# Altium project BlackChat Receiver.PrjPcb
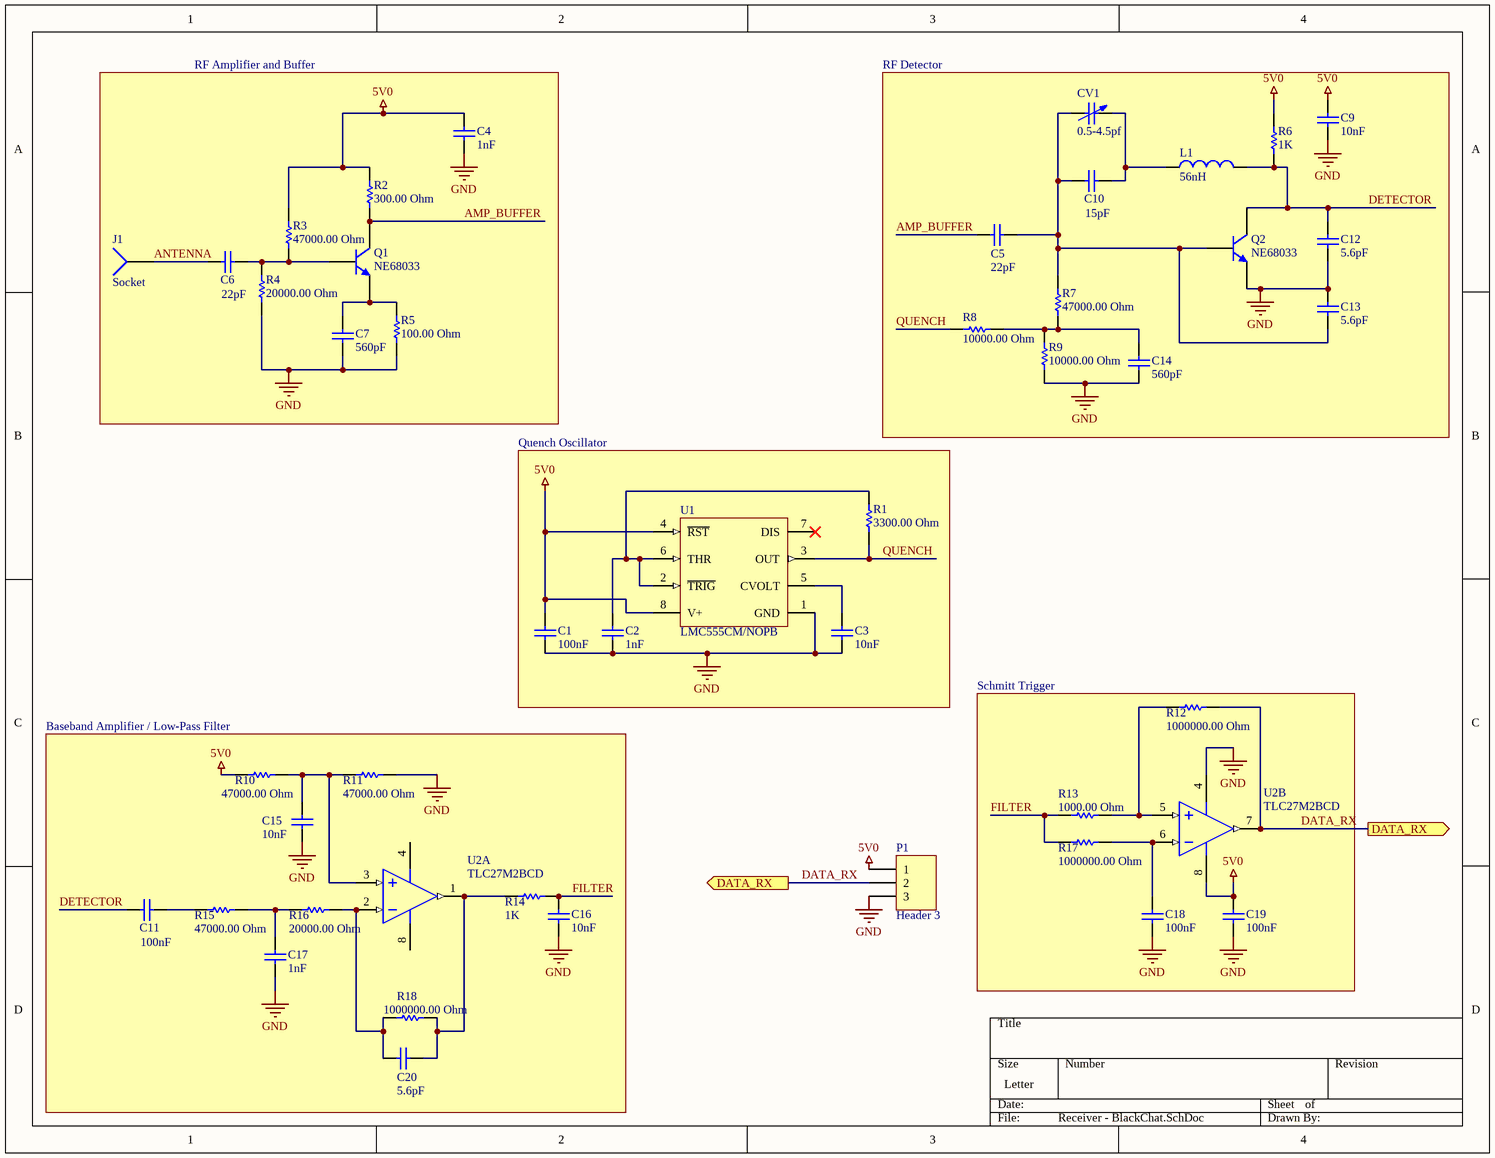
[diagram p0: Receiver - BlackChat.SchDoc]
1 sheet, 45 parts. Net scope: flat (ports and power ports of the same name join across sheets).
Board file: [R0] Receiver- BlackChat.PcbDoc

## Sheet Receiver - BlackChat.SchDoc
size Letter

### Parts
C1  value 100nF  [CAPC0805(2012)100_M]  (hidden comment: CAP 100nF 25V 0805(2012))
C2  value 1nF  [CAPC0805(2012)100_N]  (hidden comment: CAP 1nF 25V 0805(2012))
C3  value 10nF  [CAPC0805(2012)75_L]  (hidden comment: CAP 10nF 25V 0805(2012))
C4  value 1nF  [CAPC0805(2012)145_N]  (hidden comment: CAP 1nF 16V 0805(2012))
C5  value 22pF  [CAPC0805(2012)75_L]  (hidden comment: CAP 22pF 16V 0805(2012))
C6  value 22pF  [CAPC0805(2012)75_L]  (hidden comment: CAP 22pF 16V 0805(2012))
C7  value 560pF  [CAPC0805(2012)145_N]  (hidden comment: CAP 560pF 16V 0805(2012))
C9  value 10nF  [CAPC0805(2012)145_N]  (hidden comment: CAP 10nF 16V 0805(2012))
C10  value 15pF  [CAPC0805(2012)100_L]  (hidden comment: CAP 1.5pF 16V 0805(2012))
C11  value 100nF  [CAPC0805(2012)100_L]  (hidden comment: CAP 100nF 16V 0805(2012))
C12  value 5.6pF  [CAPC0805(2012)75_M]  (hidden comment: CAP 5.6pF 16V 0805(2012))
C13  value 5.6pF  [CAPC0805(2012)75_M]  (hidden comment: CAP 5.6pF 16V 0805(2012))
C14  value 560pF  [CAPC0805(2012)145_N]  (hidden comment: CAP 560pF 16V 0805(2012))
C15  value 10nF  [CAPC0805(2012)145_N]  (hidden comment: CAP 10nF 16V 0805(2012))
C16  value 10nF  [CAPC0805(2012)145_N]  (hidden comment: CAP 10nF 16V 0805(2012))
C17  value 1nF  [CAPC0805(2012)100_N]  (hidden comment: CAP 1nF 25V 0805(2012))
C18  value 100nF  [CAPC0805(2012)100_M]  (hidden comment: CAP 100nF 25V 0805(2012))
C19  value 100nF  [CAPC0805(2012)100_M]  (hidden comment: CAP 100nF 25V 0805(2012))
C20  value 5.6pF  [CAPC0805(2012)75_M]  (hidden comment: CAP 5.6pF 16V 0805(2012))
CV1  0.5-4.5pf  [CAP-GSX364]
J1  Socket  [PIN1]
L1  56nH  [C1210]
P1  Header 3  [HDR1X3]
Q1  NE68033  [SOT95P275X120-3N]
Q2  NE68033  [SOT95P275X120-3N]
R1  value 3300.00 Ohm  [RESC0805(2012)_M]  (hidden comment: 3K3 5% 0805(2012))
R2  value 300.00 Ohm  [RESC0805(2012)_M]  (hidden comment: 300R 1% 0805(2012))
R3  value 47000.00 Ohm  [RESC0805(2012)_L]  (hidden comment: 47K 5% 0805(2012))
R4  value 20000.00 Ohm  [RESC0805(2012)_L]  (hidden comment: 20K 5% 0805(2012))
R5  value 100.00 Ohm  [RESC0805(2012)_M]  (hidden comment: 100R 5% 0805(2012))
R6  value 1K  [RESC0805(2012)_N]  (hidden comment: 1K 5% 0805(2012))
R7  value 47000.00 Ohm  [RESC0805(2012)_L]  (hidden comment: 47K 5% 0805(2012))
R8  value 10000.00 Ohm  [RESC0805(2012)_L]  (hidden comment: 10K 5% 0805(2012))
R9  value 10000.00 Ohm  [RESC0805(2012)_L]  (hidden comment: 10K 5% 0805(2012))
R10  value 47000.00 Ohm  [RESC0805(2012)_N]  (hidden comment: 47K 1% 0805(2012))
R11  value 47000.00 Ohm  [RESC0805(2012)_N]  (hidden comment: 47K 1% 0805(2012))
R12  value 1000000.00 Ohm  [RESC0805(2012)_N]  (hidden comment: 1M 1% 0805(2012))
R13  value 1000.00 Ohm  [RESC0805(2012)_N]  (hidden comment: 1K 5% 0805(2012))
R14  value 1K  [RESC0805(2012)_N]  (hidden comment: 1K 5% 0805(2012))
R15  value 47000.00 Ohm  [RESC0805(2012)_N]  (hidden comment: 47K 1% 0805(2012))
R16  value 20000.00 Ohm  [RESC0805(2012)_N]  (hidden comment: 20K 1% 0805(2012))
R17  value 1000000.00 Ohm  [RESC0805(2012)_N]  (hidden comment: 1M 1% 0805(2012))
R18  value 1000000.00 Ohm  [RESC0805(2012)_N]  (hidden comment: 1M 1% 0805(2012))
U1  LMC555CM/NOPB  [M08A_M]
U2  TLC27M2BCD  [TI-D8_L]  (parts A,B of 2)

### Blocks framed on the sheet
RF Amplifier and Buffer: C4 C6 C7 J1 Q1 R2-R5
RF Detector: C5 C9 C10 C12-C14 CV1 L1 Q2 R6-R9
Quench Oscillator: C1-C3 R1 U1
Baseband Amplifier / Low-Pass Filter: C11 C15-C17 C20 R10 R11 R14-R16 R18 U2
Schmitt Trigger: C18 C19 R12 R13 R17 U2

### Ports
DATA_RX (out)

### Nets
5V0: C1.1 C4.2 C9.2 C19.1 P1.1 R2.2 R3.2 R6.2 R10.1 U1.4(~{RST}) U1.8(V+) U2.8(VCC)
GND: C1.2 C2.1 C3.1 C4.1 C7.2 C9.1 C12.1 C13.1 C14.1 C15.1 C16.1 C17.1 C18.2 C19.2 P1.3 Q2.1(E) R4.1 R5.1 R9.1 R11.2 U1.1(GND) U2.4(GND)
AMP_BUFFER: C5.1 Q1.3(C) R2.1
ANTENNA: C6.1 J1.1
DATA_RX: P1.2 R12.2 U2.7(OUT2) ; port DATA_RX
DETECTOR: C11.1 C12.2 L1.2 Q2.3(C) R6.1
FILTER: C16.2 R13.1 R14.2 R17.1
QUENCH: R1.1 R8.2 U1.3(OUT)
NetC2_2: C2.2 R1.2 U1.2(~{TRIG}) U1.6(THR)
NetC3_2: C3.2 U1.5(CVOLT)
NetC5_2: C5.2 C10.1 C13.2 CV1.1 Q2.2(B) R7.2
NetC6_2: C6.2 Q1.2(B) R3.1 R4.2
NetC7_1: C7.1 Q1.1(E) R5.2
NetC10_2: C10.2 CV1.2 L1.1
NetC11_2: C11.2 R15.1
NetC14_2: C14.2 R7.1 R8.1 R9.2
NetC15_2: C15.2 R10.2 R11.1 U2.3(IN1+)
NetC17_2: C17.2 R15.2 R16.1
NetC18_1: C18.1 R17.2 U2.6(IN2-)
NetC20_1: C20.1 R14.1 R18.2 U2.1(OUT1)
NetC20_2: C20.2 R16.2 R18.1 U2.2(IN1-)
NetR12_1: R12.1 R13.2 U2.5(IN2+)

Not connected (* = marked no-connect by the designer): U1 7(DIS)*

### Library data of the parts
C1 C18 C19 = CMP-1036-04409-1: CAP 100nF 25V ±5% 0805 (2012 Metric) Thickness 1mm SMD; Case-EIA: 0805; Case-Metric: 2012; Max Thickness: 1 mm; Technology: SMT; Rated Voltage: 25 V; Tolerance: ±5%
C2 C17 = CMP-1036-02963-1: CAP 1nF 25V ±1% 0805 (2012 Metric) Thickness 1mm SMD; Case-EIA: 0805; Case-Metric: 2012; Rated Voltage: 25 V; Max Thickness: 1 mm; Technology: SMT; Tolerance: ±1%
C3 = CMP-1036-03827-1: CAP 10nF 25V ±5% 0805 (2012 Metric) Thickness 0.75mm SMD; Case-EIA: 0805; Case-Metric: 2012; Technology: SMT; Tolerance: ±5%; Max Thickness: 0.75 mm; Rated Voltage: 25 V
C4 = CMP-1036-02959-1: CAP 1nF 16V ±10% 0805 (2012 Metric) Thickness 1.45mm SMD; Case-EIA: 0805; Case-Metric: 2012; Rated Voltage: 16 V; Tolerance: ±10%; Max Thickness: 1.45 mm; Technology: SMT
C5 = CMP-1036-00271-1: CAP 22pF 16V ±0.5pF 0805 (2012 Metric) Thickness 0.75mm SMD; Case-EIA: 0805; Case-Metric: 2012; Max Thickness: 0.75 mm; Technology: SMT; Rated Voltage: 16 V; Tolerance: ±0.5pF
C6 = CMP-1036-01219-1: CAP 22pF 16V ±5% 0805 (2012 Metric) Thickness 0.75mm SMD; Case-Metric: 2012; Case-EIA: 0805; Technology: SMT; Max Thickness: 0.75 mm; Tolerance: ±5%; Rated Voltage: 16 V
C7 C14 = CMP-1036-02734-1: CAP 560pF 16V ±10% 0805 (2012 Metric) Thickness 1.45mm SMD; Case-Metric: 2012; Case-EIA: 0805; Rated Voltage: 16 V; Technology: SMT; Tolerance: ±10%; Max Thickness: 1.45 mm
C9 C15 C16 = CMP-1036-03817-1: CAP 10nF 16V ±5% 0805 (2012 Metric) Thickness 1.45mm SMD; Case-EIA: 0805; Case-Metric: 2012; Technology: SMT; Rated Voltage: 16 V; Max Thickness: 1.45 mm; Tolerance: ±5%
C10 = CMP-1036-00160-1: CAP 1.5pF 16V ±0.1pF 0805 (2012 Metric) Thickness 1mm SMD; Case-Metric: 2012; Case-EIA: 0805; Rated Voltage: 16 V; Technology: SMT; Tolerance: ±0.1pF; Max Thickness: 1 mm
C11 = CMP-1036-04400-1: CAP 100nF 16V ±5% 0805 (2012 Metric) Thickness 1mm SMD; Case-EIA: 0805; Case-Metric: 2012; Max Thickness: 1 mm; Tolerance: ±5%; Technology: SMT; Rated Voltage: 16 V
C12 C13 C20 = CMP-1036-00602-1: CAP 5.6pF 16V ±0.25pF 0805 (2012 Metric) Thickness 0.75mm SMD; Case-Metric: 2012; Case-EIA: 0805; Technology: SMT; Max Thickness: 0.75 mm; Tolerance: ±0.25pF; Rated Voltage: 16 V
CV1 = GSX364: 0.5pF to 4.5pF variable capacitor.; Value: 0.5-4.5pf
L1 = Inductor: Generic Inductor; Value: 56nH
P1 = Header 3: Header, 3-Pin; LatestRevisionDate: 17-Jul-2002; LatestRevisionNote: Re-released for DXP Platform.; Publisher: Altium Limited
Q1 Q2 = NE68033: NPN SILICON HIGH FREQUENCY TRANSISTOR
R1 = CMP-1013-00086-1: 3K3 0.125W 5% 0805 (2012 Metric)  SMD; Case-Metric: 2012; Case-EIA: 0805; Tolerance: 5 %; Technology: SMT; Power: 0.125 W
R2 = CMP-1013-00449-1: 300R 0.125W 1% 0805 (2012 Metric)  SMD; Case-Metric: 2012; Case-EIA: 0805; Technology: SMT; Tolerance: 1 %; Power: 0.125 W
R3 R7 = CMP-1013-00114-1: 47K 0.125W 5% 0805 (2012 Metric)  SMD; Case-Metric: 2012; Case-EIA: 0805; Tolerance: 5 %; Power: 0.125 W; Technology: SMT
R4 = CMP-1013-00105-1: 20K 0.125W 5% 0805 (2012 Metric)  SMD; Case-Metric: 2012; Case-EIA: 0805; Technology: SMT; Power: 0.125 W; Tolerance: 5 %
R5 = CMP-1013-00050-1: 100R 0.125W 5% 0805 (2012 Metric)  SMD; Case-EIA: 0805; Case-Metric: 2012; Tolerance: 5 %; Power: 0.125 W; Technology: SMT
R6 R13 R14 = CMP-1013-00074-1: 1K 0.125W 5% 0805 (2012 Metric)  SMD; Case-EIA: 0805; Case-Metric: 2012; Technology: SMT; Power: 0.125 W; Tolerance: 5 %
R8 R9 = CMP-1013-00098-1: 10K 0.125W 5% 0805 (2012 Metric)  SMD; Case-EIA: 0805; Case-Metric: 2012; Power: 0.125 W; Technology: SMT; Tolerance: 5 %
R10 R11 R15 = CMP-1013-00699-1: 47K 0.125W 1% 0805 (2012 Metric)  SMD; Case-Metric: 2012; Case-EIA: 0805; Power: 0.125 W; Tolerance: 1 %; Technology: SMT
R12 R17 R18 = CMP-1013-00849-1: 1M 0.125W 1% 0805 (2012 Metric)  SMD; Case-Metric: 2012; Case-EIA: 0805; Technology: SMT; Power: 0.125 W; Tolerance: 1 %
R16 = CMP-1013-00655-1: 20K 0.125W 1% 0805 (2012 Metric)  SMD; Case-EIA: 0805; Case-Metric: 2012; Power: 0.125 W; Tolerance: 1 %; Technology: SMT
U1 = CMP-0056-00124-2: CMOS Timer, 8-pin Narrow SOIC, Pb-Free; Manufacturer: National Semiconductor; PackageTopMarking: NSZXTT*LMC*555CM; PowerWise: N; CompType: Analog IC; DatasheetVersion: May-2006; ComponentLink2URL: http://www.national.com/pf/LM/LMC555.html; ComponentLink3URL: http://www.national.com/packaging/folders/m08a.html; PackageVersion: revM, May-2009; PackageDescription: SOIC Narrow, 4.9 x 3.9 x 1.45mm, 8 Lead, 1.27mm Pitch; Code_JEDEC: MS-012-AA; ComponentLink1URL: http://www.national.com/ds/LM/LMC555.pdf; RoHS: Y; PinCount: 8; Code_IPC: SOIC127P600-8; ComponentLink3Description: M08A Package Page; ComponentLink1Description: LMC555 Datasheet; PackageReference: M08A; ComponentLink2Description: LMC555 Web Page; RevisionNote: Component URLs added
U2 = CMP-0017-00353-1: LinCMOS(TM) Precision Dual Operational Amplifier, 3 to 16 V, 0 to 70 degC, 8-pin SOIC (D8), Green (RoHS & no Sb/Br); Manufacturer: Texas Instruments; Total Supply Voltage(Max)(+5V is 5, +/-5V is 10): 16; Rating: Catalog; Number of Channels: 2; IIB(Max)(pA): 600; Vn at 1kHz(Typ)(nV/rtHz): 32; Offset Drift(Typ)(uV/C): 1.7; CMRR(Min)(dB): 65; Iq per channel(Max)(mA): 0.28; Total Supply Voltage(Min)(+5V is 5, +/-5V is 10): 3; GBW(Typ)(MHz): 0.525; Slew Rate(Typ)(V/us): 0.43; Sub Family: General Purpose Amplifier, Low Power Amp (<=500uA); ComponentLink1Description: Manufacturer URL; Mounting Technology: Surface Mount; ComponentLink1URL: http://www.ti.com/; PartNumber: TLC27M2BCD; ComponentLink3Description: Package Specification; ComponentLink3URL: http://www.ti.com/litv/pdf/msoi002j; PackageVersion: 4040047-3/M, 06/2011; ComponentLink2URL: http://www.ti.com/lit/ds/symlink/tlc27m2b.pdf; Eco-Plan: Green (RoHS & no Sb/Br); PackageDescription: 8-Pin Plastic Small Outline, Body 4.9 x 3.9 mm, Pitch 1.27 mm; Vio (25C)(Max)(mV): 2; Code_JEDEC: MS-012; ComponentLink2Description: Datasheet; PackageReference: D8; DatasheetVersion: SLOS051E
J1 = Socket: LatestRevisionDate: 17-Jul-2002; LatestRevisionNote: Re-released for DXP Platform.; Publisher: Altium Limited